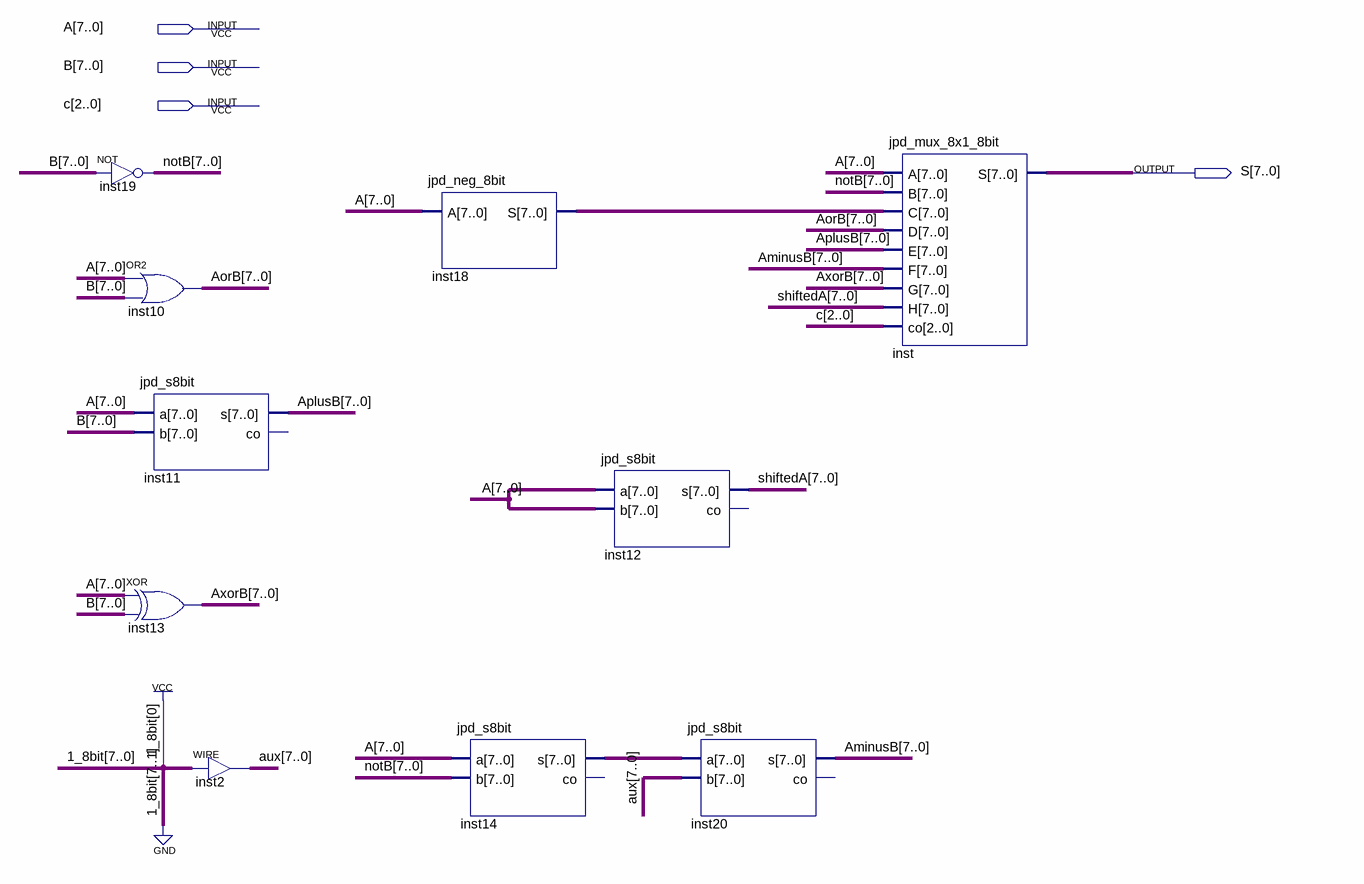
[diagram p0: schematic sheet]
// Quartus schematic jpd_generic_ula.bdf as structural Verilog: 10 symbols, 4 pins
module jpd_generic_ula (
  input  [7:0] A,
  input  [7:0] B,
  input  [2:0] c,
  output [7:0] S
);

  wire [7:0] AminusB, AorB, AplusB, aux, AxorB, inst14_s, inst18_s, notB, shiftedA;

  assign notB = ~B;  // NOT inst19, 8 bits wide
  assign AorB = A | B;  // OR2 inst10, 8 bits wide
  assign AxorB = A ^ B;  // XOR inst13, 8 bits wide
  jpd_s8bit inst11 (.a(A), .b(B), .s(AplusB));  // open: co
  assign aux = 8'b00000001;  // WIRE inst2
  jpd_neg_8bit inst18 (.A(A), .S(inst18_s));
  jpd_s8bit inst14 (.a(A), .b(notB), .s(inst14_s));  // open: co
  jpd_s8bit inst12 (.a(A), .b(A), .s(shiftedA));  // open: co
  jpd_s8bit inst20 (.a(inst14_s), .b(aux), .s(AminusB));  // open: co
  jpd_mux_8x1_8bit inst (
    .A(A), .B(notB), .C(inst18_s), .D(AorB), .E(AplusB), .F(AminusB), .G(AxorB), .H(shiftedA), .co(c), .S(S));
endmodule
